# Altium schematic sheet Block Diagram.SchDoc
size A3; ApprovedBy: R&D Department Manager; CheckedBy: R&D Department; Revision: AA; SheetNumber: 2; SheetTotal: 5; ReleaseDate: 10.02.2022
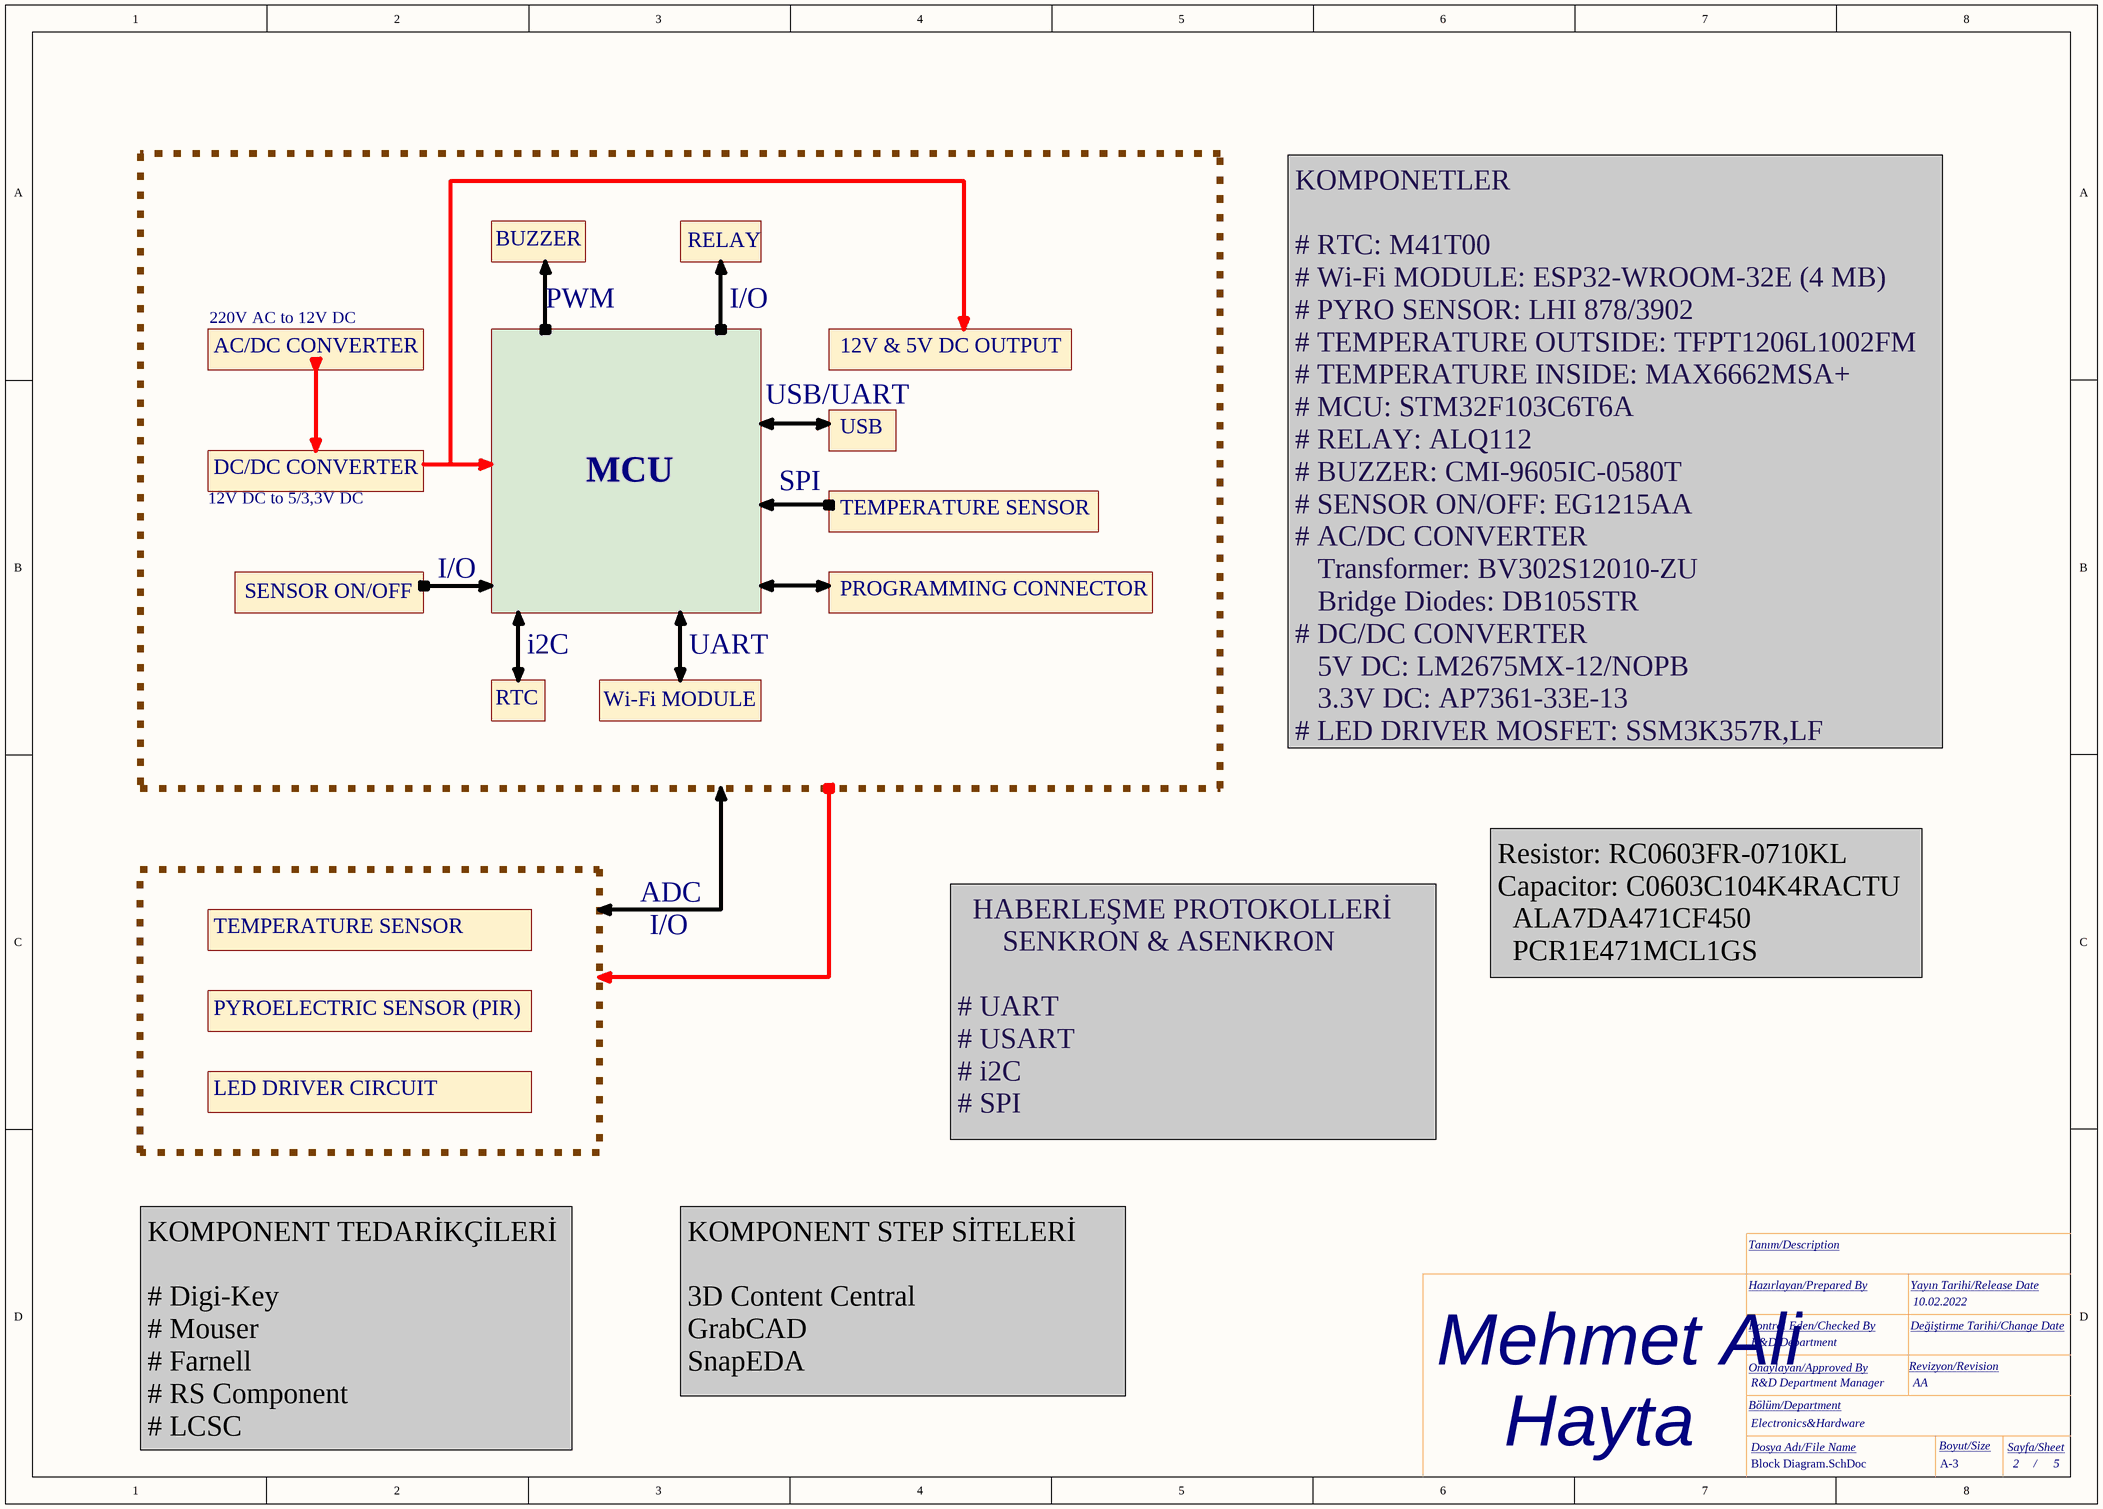
[diagram p0: Block Diagram.SchDoc]

## Notes on the sheet
- BUZZER
- RELAY
- PWM
- I/O
- 220V AC to 12V DC
- AC/DC CONVERTER
- 12V & 5V DC OUTPUT
- USB/UART
- USB
- 12V DC to 5/3,3V DC
- DC/DC CONVERTER
- MCU
- SPI
- TEMPERATURE SENSOR
- SENSOR ON/OFF
- PROGRAMMING CONNECTOR
- RTC
- i2C
- Wi-Fi MODULE
- UART
- KOMPONETLER
  # RTC: M41T00
  # Wi-Fi MODULE: ESP32-WROOM-32E (4 MB)
  # PYRO SENSOR: LHI 878/3902
  # TEMPERATURE OUTSIDE: TFPT1206L1002FM
  # TEMPERATURE INSIDE: MAX6662MSA+
  # MCU: STM32F103C6T6A
  # RELAY: ALQ112
  # BUZZER: CMI-9605IC-0580T
  # SENSOR ON/OFF: EG1215AA
  # AC/DC CONVERTER
  Transformer: BV302S12010-ZU
  Bridge Diodes: DB105STR
  # DC/DC CONVERTER
  5V DC: LM2675MX-12/NOPB
  3.3V DC: AP7361-33E-13
  # LED DRIVER MOSFET: SSM3K357R,LF
- ADC
- Resistor: RC0603FR-0710KL
  Capacitor: C0603C104K4RACTU
  ALA7DA471CF450
  PCR1E471MCL1GS
- PYROELECTRIC SENSOR (PIR)
- LED DRIVER CIRCUIT
- HABERLEŞME PROTOKOLLERİ
  SENKRON & ASENKRON
  # UART
  # USART
  # i2C
  # SPI
- KOMPONENT STEP SİTELERİ
  3D Content Central
  GrabCAD
  SnapEDA
- KOMPONENT TEDARİKÇİLERİ
  # Digi-Key
  # Mouser
  # Farnell
  # RS Component
  # LCSC
- Tanım/Description
- Hazırlayan/Prepared By
- Kontrol Eden/Checked By
- Değiştirme Tarihi/Change Date
- Yayın Tarihi/Release Date
- Mehmet Ali
- Onaylayan/Approved By
- Revizyon/Revision
- Hayta
- Bölüm/Department
- Dosya Adı/File Name
- Electronics&Hardware
- Boyut/Size
- Sayfa/Sheet
- A-3
- /